# Altium schematic sheet Top Level.SchDoc
size B; Author: DM; CompanyName: Silver Bullet Technology LLC; DrawnBy: D.McIntire; Engineer: DM; Organization: Silver Bullet Technology; Address1: Schematic; Address2: 5300 Via Andrea; Address3: Newbury Park, CA 91320; Address4: USA; DocumentNumber: 2; SheetNumber: 2; SheetTotal: 6
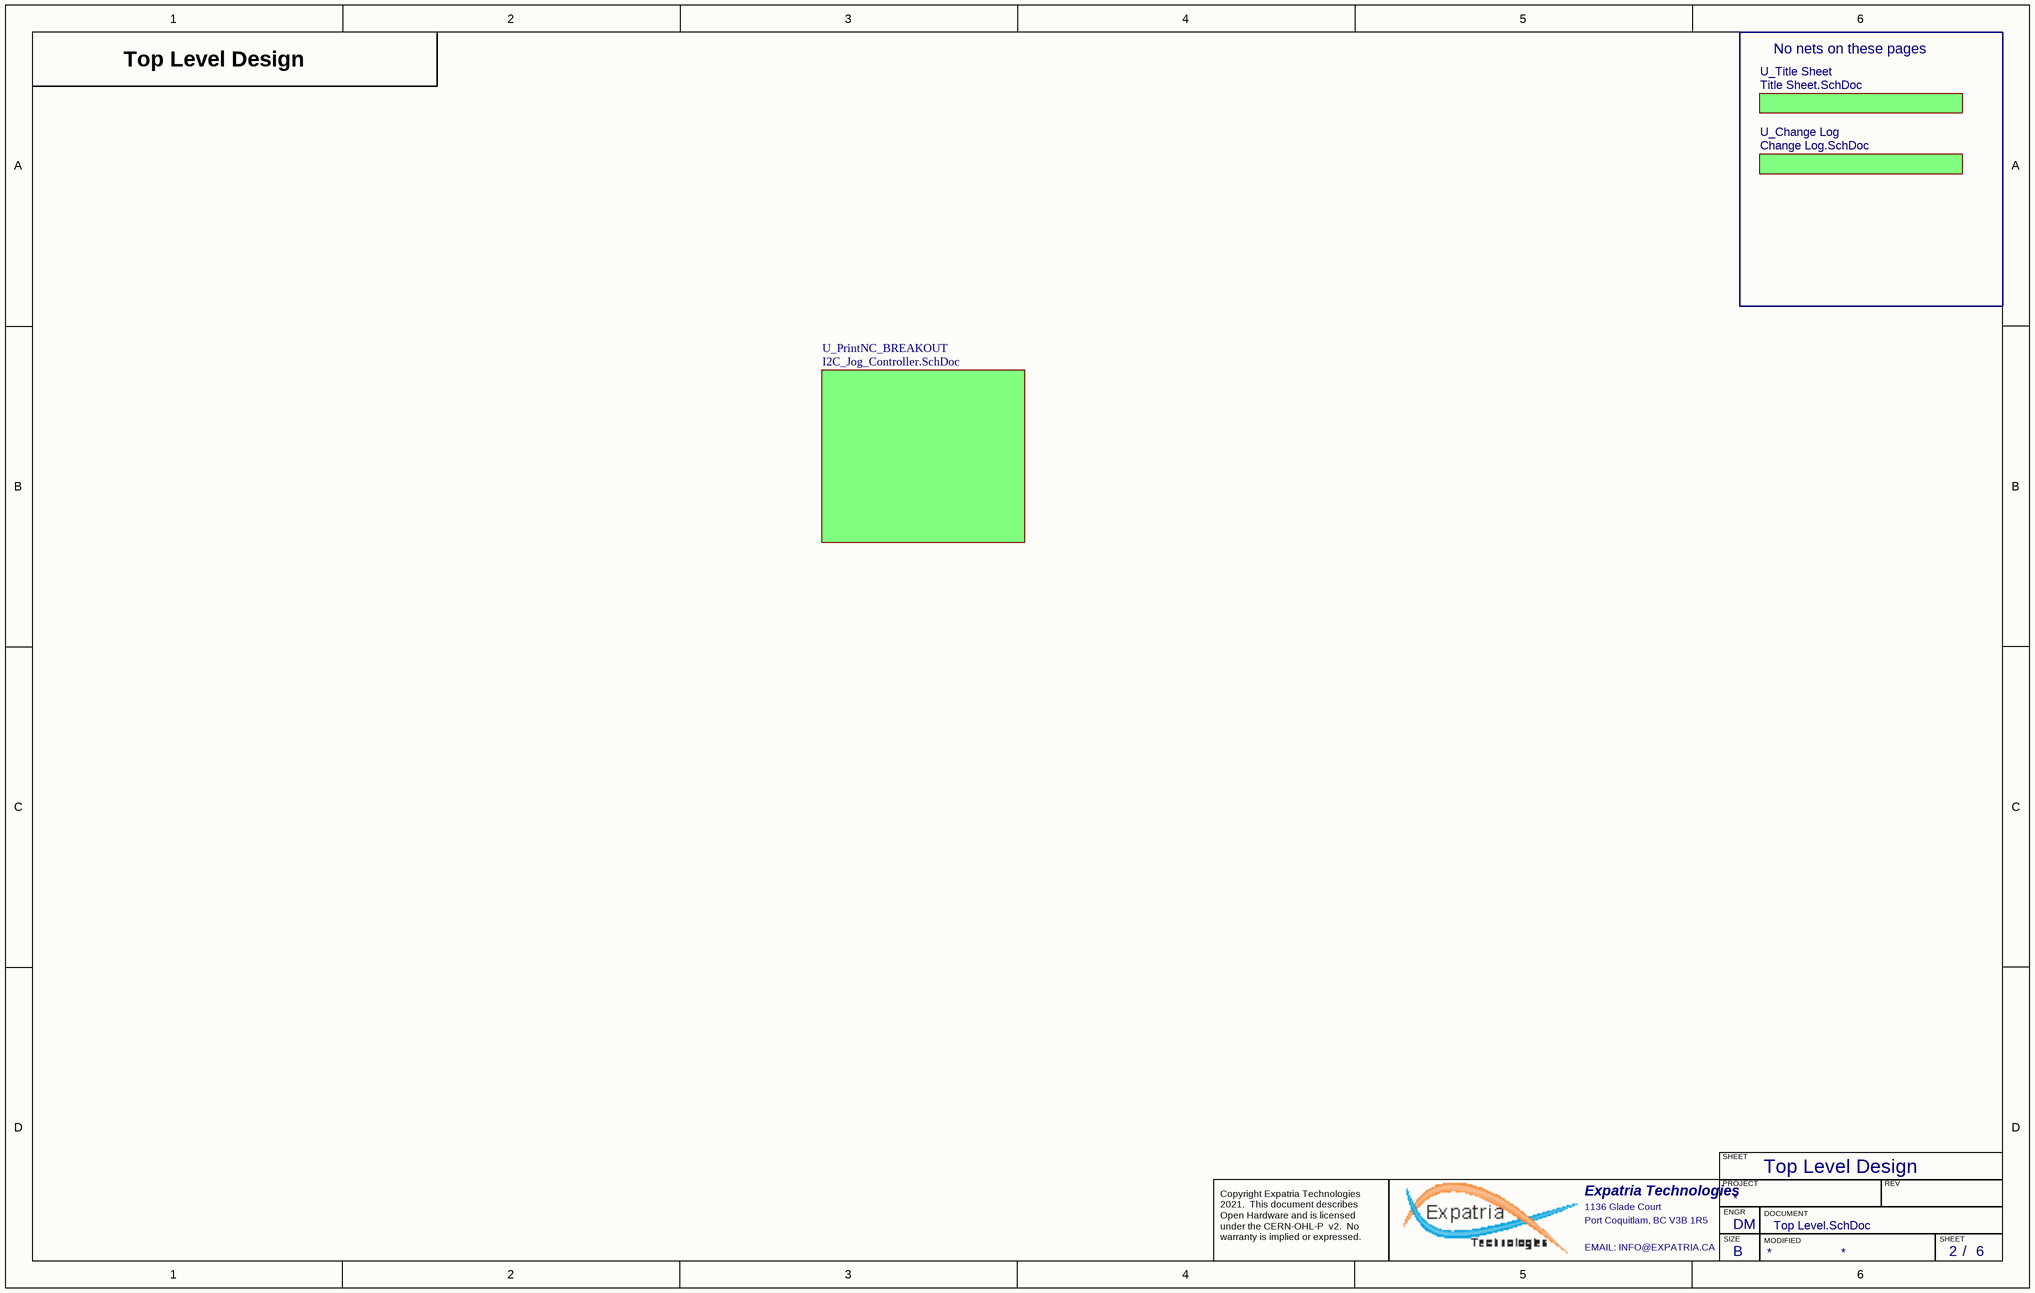
[diagram p0: Top Level.SchDoc]

## Sub-sheets
U_Change Log = Change Log.SchDoc: no entries
U_PrintNC_BREAKOUT = I2C_Jog_Controller.SchDoc: no entries
U_Title Sheet = Title Sheet.SchDoc: no entries

## Notes on the sheet
- Top Level Design
- No nets on these pages
- SHEET
- Expatria Technologies
- 1136 Glade Court
- Port Coquitlam, BC V3B 1R5
- PROJECT
- SIZE
- ENGR
- MODIFIED
- DOCUMENT
- REV
- Copyright Expatria Technologies 2021.  This document describes Open Hardware and is licensed under the CERN-OHL-P  v2.  No warranty is implied or expressed.
- EMAIL: INFO@EXPATRIA.CA
- B
- /